# EAGLE design mainboard (EAGLE 9.6.1)
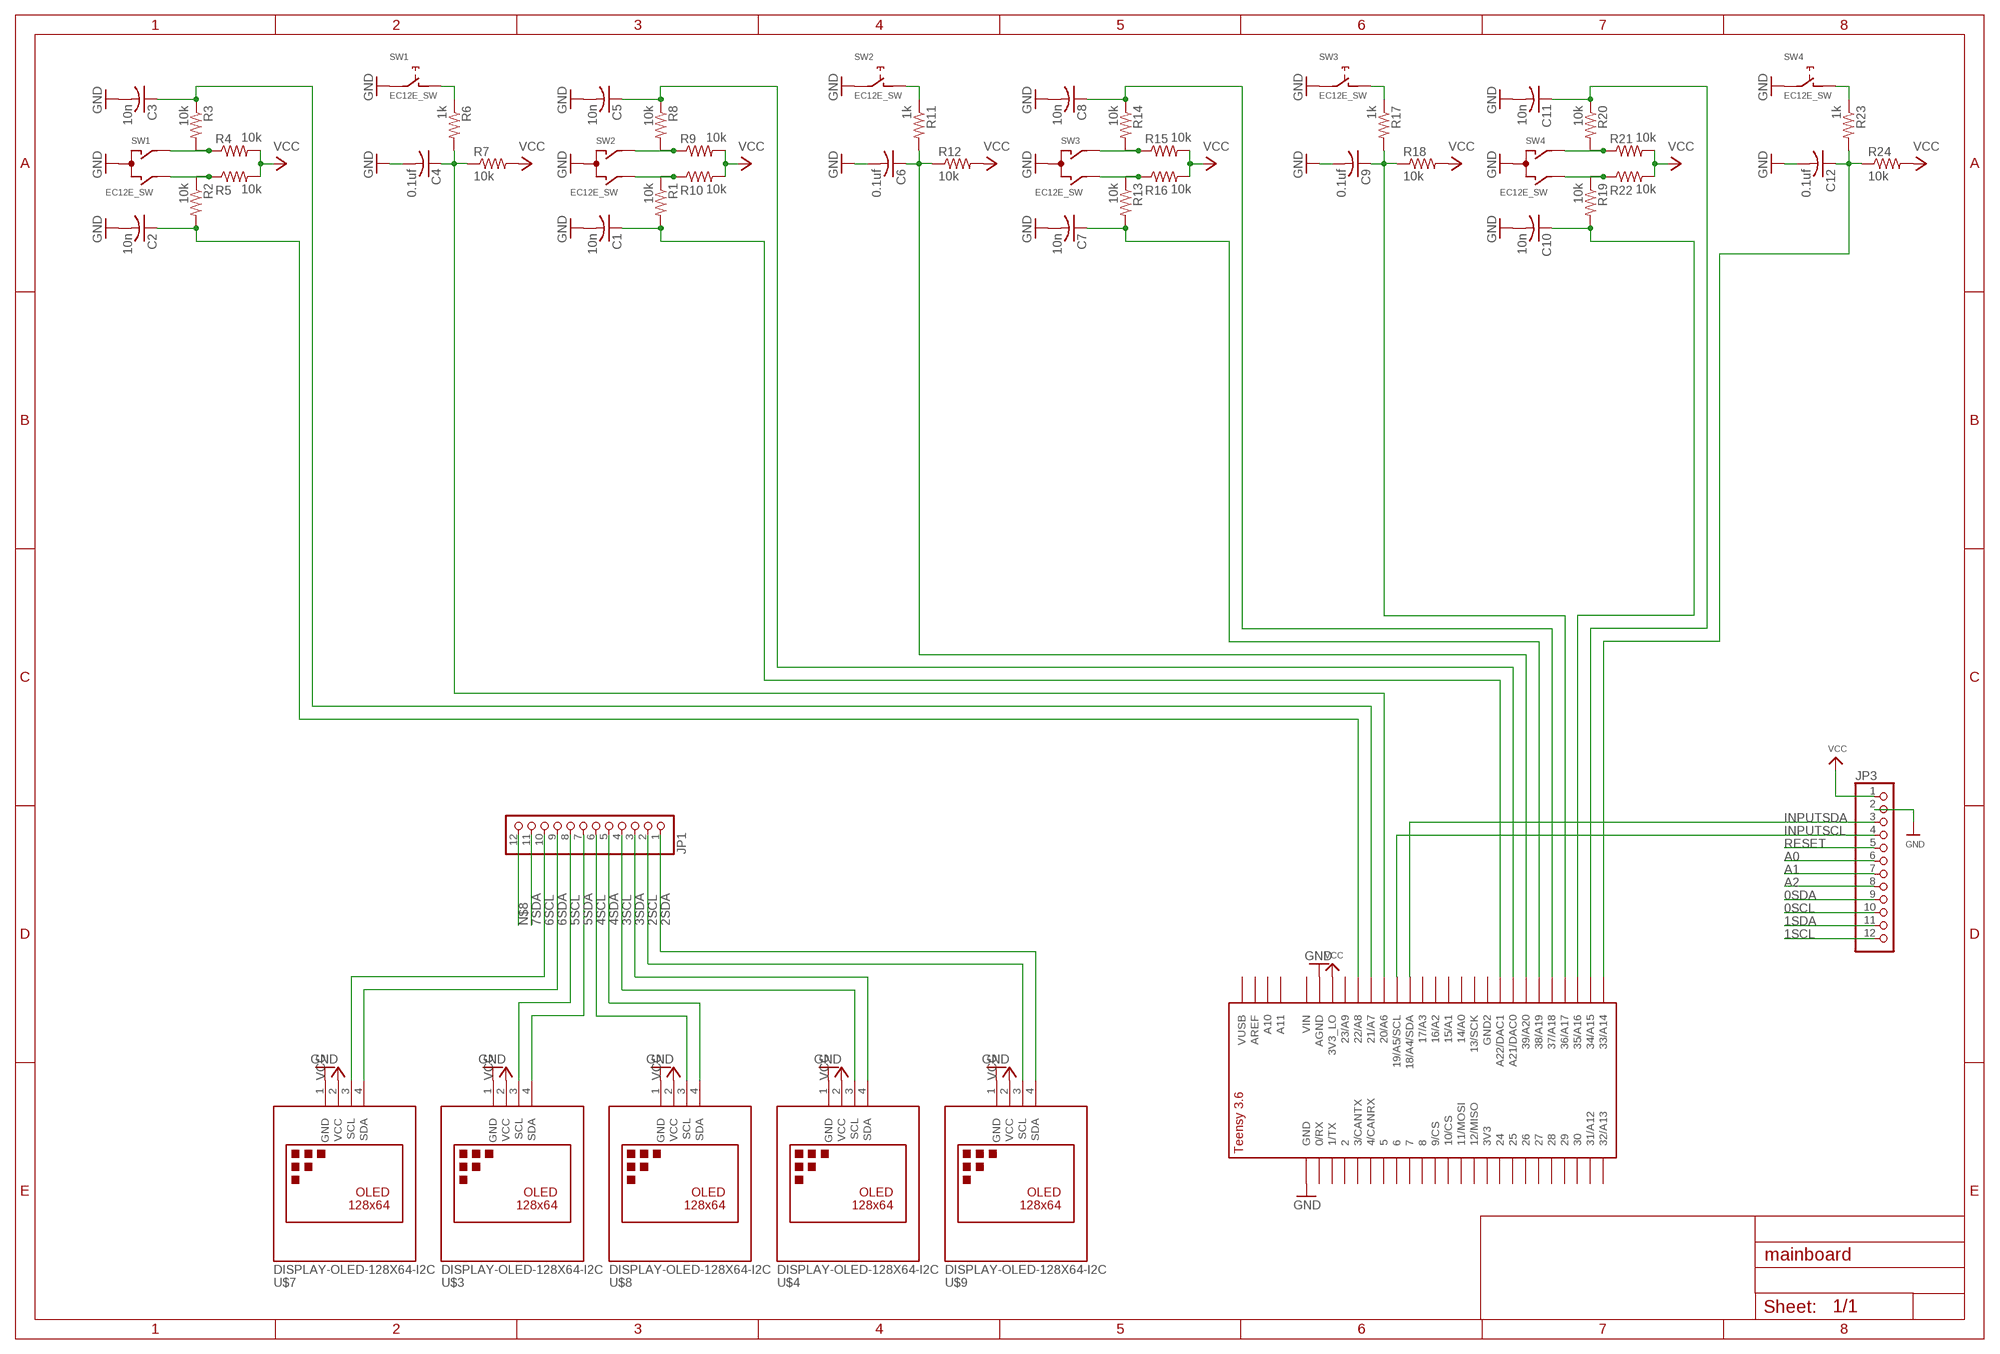
[diagram p0: schematic, sheet 1]

## Parts
C1  10n  C-US050-025X075  [C050-025X075]
C2  10n  C-US050-025X075  [C050-025X075]
C3  10n  C-US050-025X075  [C050-025X075]
C4  0.1uf  C-US050-025X075  [C050-025X075]
C5  10n  C-US050-025X075  [C050-025X075]
C6  0.1uf  C-US050-025X075  [C050-025X075]
C7  10n  C-US050-025X075  [C050-025X075]
C8  10n  C-US050-025X075  [C050-025X075]
C9  0.1uf  C-US050-025X075  [C050-025X075]
C10  10n  C-US050-025X075  [C050-025X075]
C11  10n  C-US050-025X075  [C050-025X075]
C12  0.1uf  C-US050-025X075  [C050-025X075]
JP1  HEADER-1X12  [1X12_ROUND]
JP3  HEADER-1X12  [1X12_ROUND]
R1  10k  R-US_0207/9  [0207/9]
R2  10k  R-US_0207/9  [0207/9]
R3  10k  R-US_0207/9  [0207/9]
R4  10k  R-US_0207/9  [0207/9]
R5  10k  R-US_0207/9  [0207/9]
R6  1k  R-US_0207/9  [0207/9]
R7  10k  R-US_0207/9  [0207/9]
R8  10k  R-US_0207/9  [0207/9]
R9  10k  R-US_0207/9  [0207/9]
R10  10k  R-US_0207/9  [0207/9]
R11  1k  R-US_0207/9  [0207/9]
R12  10k  R-US_0207/9  [0207/9]
R13  10k  R-US_0207/9  [0207/9]
R14  10k  R-US_0207/9  [0207/9]
R15  10k  R-US_0207/9  [0207/9]
R16  10k  R-US_0207/9  [0207/9]
R17  1k  R-US_0207/9  [0207/9]
R18  10k  R-US_0207/9  [0207/9]
R19  10k  R-US_0207/9  [0207/9]
R20  10k  R-US_0207/9  [0207/9]
R21  10k  R-US_0207/9  [0207/9]
R22  10k  R-US_0207/9  [0207/9]
R23  1k  R-US_0207/9  [0207/9]
R24  10k  R-US_0207/9  [0207/9]
SW1  EC12E_SW  [ALPS_EC12E_SW]
SW2  EC12E_SW  [ALPS_EC12E_SW]
SW3  EC12E_SW  [ALPS_EC12E_SW]
SW4  EC12E_SW  [ALPS_EC12E_SW]
U$1  TEENSY_3.5/3.6_BASIC  [TEENSY_3.5/3.6_BASIC]
U$3  DISPLAY-OLED-128X64-I2C  [DISPLAY-OLED-128X64-I2C]
U$4  DISPLAY-OLED-128X64-I2C  [DISPLAY-OLED-128X64-I2C]
U$7  DISPLAY-OLED-128X64-I2C  [DISPLAY-OLED-128X64-I2C]
U$8  DISPLAY-OLED-128X64-I2C  [DISPLAY-OLED-128X64-I2C]
U$9  DISPLAY-OLED-128X64-I2C  [DISPLAY-OLED-128X64-I2C]

## Nets
0SCL: JP3.10
0SDA: JP3.9
1SCL: JP3.12
1SDA: JP3.11
2SCL: JP1.2 U$9.3(SCL)
2SDA: JP1.1 U$9.4(SDA)
3SCL: JP1.4 U$4.3(SCL)
3SDA: JP1.3 U$4.4(SDA)
4SCL: JP1.6 U$8.3(SCL)
4SDA: JP1.5 U$8.4(SDA)
5SCL: JP1.8 U$3.3(SCL)
5SDA: JP1.7 U$3.4(SDA)
6SCL: JP1.10 U$7.3(SCL)
6SDA: JP1.9 U$7.4(SDA)
7SDA: JP1.11
A0: JP3.6
A1: JP3.7
A2: JP3.8
GND: C1.2 C2.2 C3.2 C4.2 C5.2 C6.2 C7.2 C8.2 C9.2 C10.2 C11.2 C12.2 JP3.2 SW1.C SW1.E SW2.C SW2.E SW3.C SW3.E SW4.C SW4.E U$1.AGND U$1.GND U$3.1(GND) U$4.1(GND) U$7.1(GND) U$8.1(GND) U$9.1(GND)
INPUTSCL: JP3.4 U$1.19/A5/SCL
INPUTSDA: JP3.3 U$1.18/A4/SDA
N$1: R2.1 R5.1 SW1.B
N$2: R3.2 R4.1 SW1.A
N$3: C2.1 R2.2 U$1.22/A8
N$4: R6.1 SW1.D
N$5: C3.1 R3.1 U$1.21/A7
N$6: C4.1 R6.2 R7.1 U$1.20/A6
N$7: R1.1 R10.1 SW2.B
N$8: JP1.12
N$9: R8.2 R9.1 SW2.A
N$10: C1.1 R1.2 U$1.A22/DAC1
N$11: C5.1 R8.1 U$1.21/DAC0(A21/DAC0)
N$12: R11.1 SW2.D
N$13: C6.1 R11.2 R12.1 U$1.39/A20
N$14: R13.1 R16.1 SW3.B
N$15: R14.2 R15.1 SW3.A
N$16: C7.1 R13.2 U$1.38/A19
N$17: C8.1 R14.1 U$1.37/A18
N$18: R17.1 SW3.D
N$19: C9.1 R17.2 R18.1 U$1.36/A17
N$20: R19.1 R22.1 SW4.B
N$21: R20.2 R21.1 SW4.A
N$22: C10.1 R19.2 U$1.35/A16
N$23: C11.1 R20.1 U$1.34/A15
N$24: R23.1 SW4.D
N$25: C12.1 R23.2 R24.1 U$1.33/A14
RESET: JP3.5
VCC: JP3.1 R4.2 R5.2 R7.2 R9.2 R10.2 R12.2 R15.2 R16.2 R18.2 R21.2 R22.2 R24.2 U$1.3V3_LO U$3.2(VCC) U$4.2(VCC) U$7.2(VCC) U$8.2(VCC) U$9.2(VCC)
Unconnected: SW1.GND1(G) SW1.GND2(G) SW2.GND1(G) SW2.GND2(G) SW3.GND1(G) SW3.GND2(G) SW4.GND1(G) SW4.GND2(G) U$1.0/RX U$1.1/TX U$1.2 U$1.3/CANTX U$1.3V3 U$1.4/CANRX U$1.5 U$1.6 U$1.7 U$1.8 U$1.9/CS U$1.10/CS U$1.11/MOSI U$1.12/MISO U$1.13/SCK U$1.14/A0 U$1.15/A1 U$1.16/A2 U$1.17/A3 U$1.23/A9 U$1.24 U$1.25 U$1.26 U$1.27 U$1.28 U$1.29 U$1.30 U$1.31/A12 U$1.32/A13 U$1.A10 U$1.A11 U$1.AREF U$1.GND2 U$1.VIN U$1.VUSB

## Library data of the parts
C1-C12 = adafruit:C-US: CAPACITOR, American symbol
JP1 JP3 = microbuilder:HEADER-1X12
R1-R24 = adafruit:R-US_: RESISTOR, American symbol
SW1-SW4 = switch-alps:EC12E_SW: ALPS rotary Encoder EC12E series with switch; MPN: EC12E2424407; OC_FARNELL: 1520813; OC_NEWARK: 74M1068
U$1 = Teensy356:TEENSY_3.5/3.6_BASIC
U$3 U$4 U$7-U$9 = diy-modules:DISPLAY-OLED-128X64-I2C: 128x64 Dot Matrix OLED Module based on SSD1306 chip Variant with I2C interface More details available here: http://www.instructables.com/id/Monochrome-096-i2c-OLED-display-with-arduino-SSD13/ SSD1306 datasheet: https://cdn-shop.adafruit.com/datasheets/SSD1306.pdf Click here to find device on ebay.com <http://www.ebay.com/sch/oled+display+128x64+iic> Note: There are two variants: I2C and SPI. Search for the proper version.

## Board
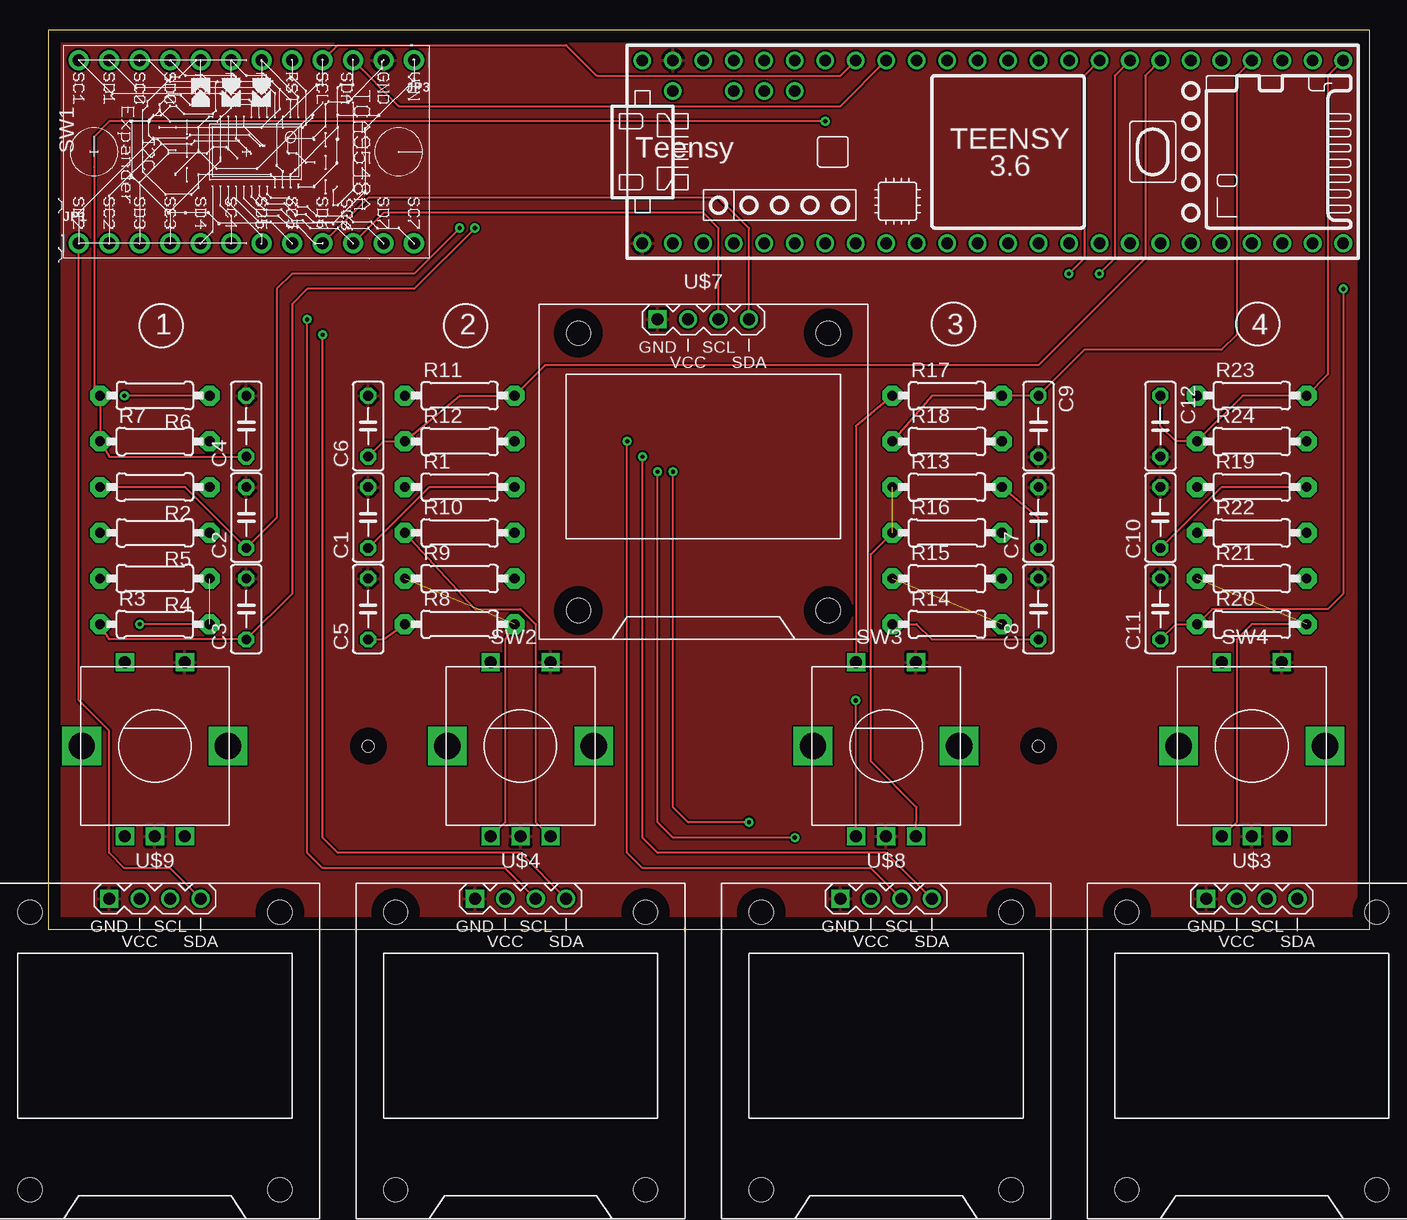
[diagram p1: board, top side]
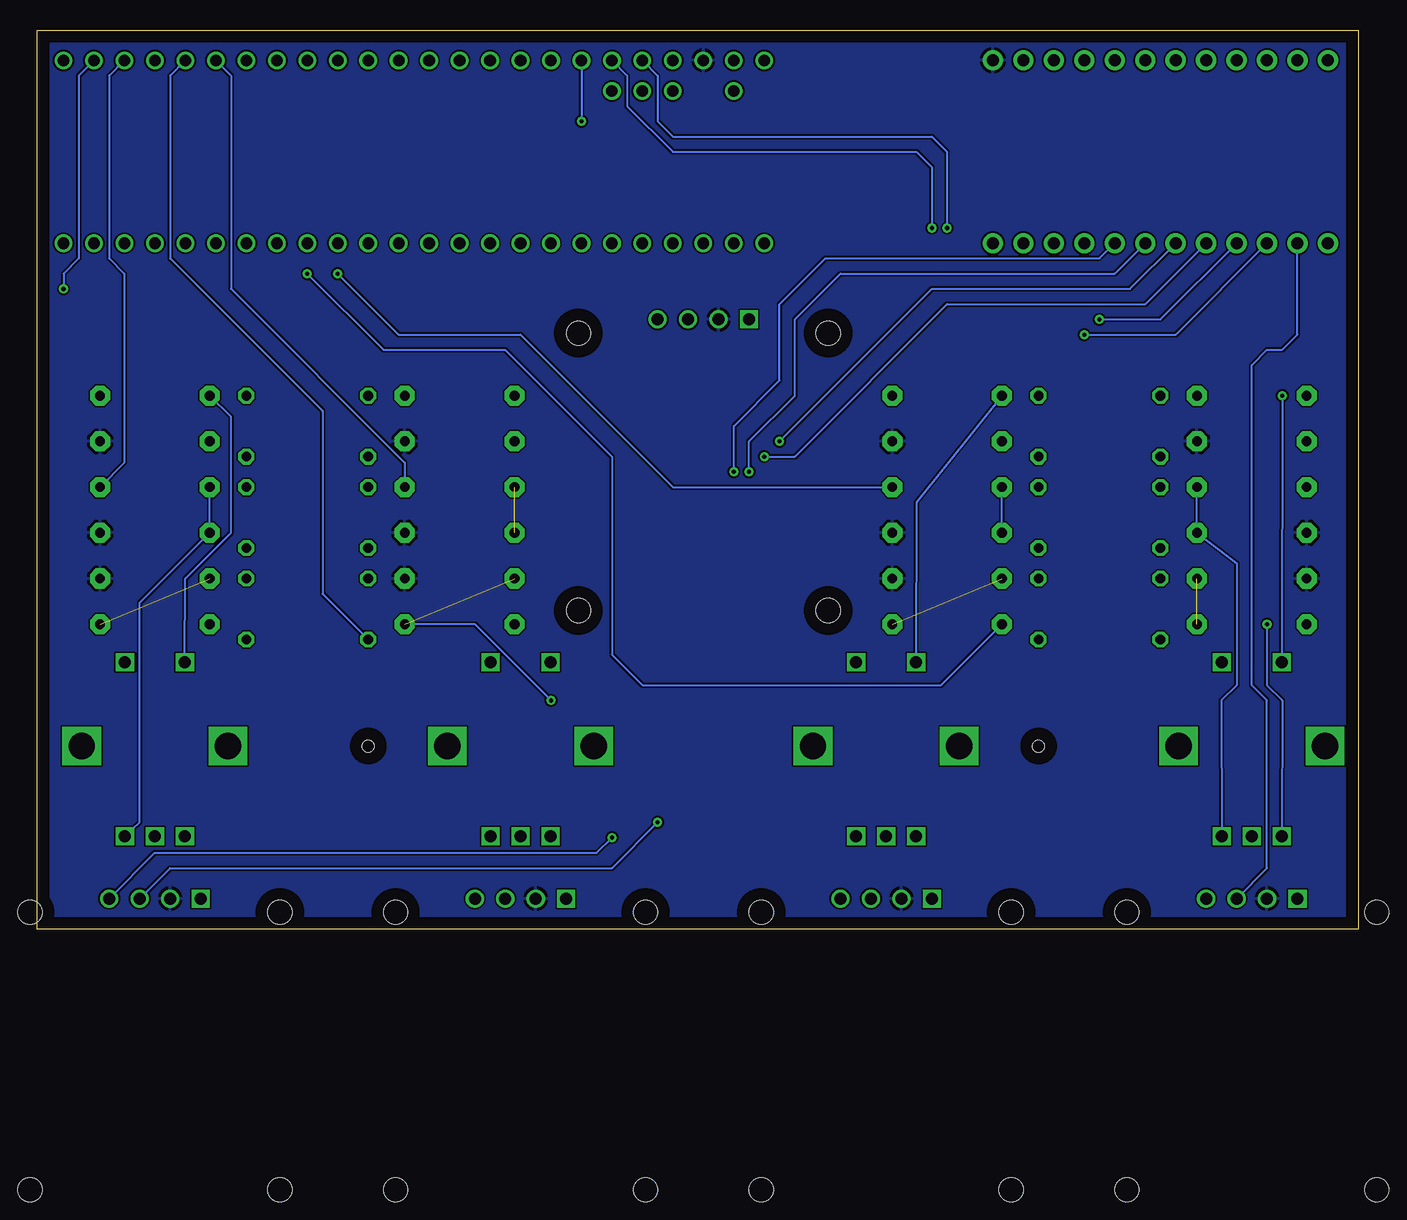
[diagram p2: board, bottom side, seen from below]

Size 110.16 x 74.92 mm. Coordinates in mm from the lower left corner, seen from the top.
Outline: 0,0 110.16,0 110.16,74.92 0,74.92 0,0
Copper layers (1*16): Top 0.035mm / dielectric 1.5mm / Bottom 0.035mm
Design rules "default": minimum track width 6mil, minimum drill 0.35mm, track to track 6mil, track to pad 6mil, pad to pad 6mil, via to via 6mil, smd to smd 6mil, copper to edge 40mil, drill to drill 6mil, minimum pad ring 10mil, minimum via ring 8mil, stop-mask expansion 4mil, vias tented up to drill 0mil, thermal gap 10mil
Holes 1 mm at 26.67,15.24 82.55,15.24

### Footprints (pad centres in the part's own frame; a part is rotated, then mirrored left to right if it is on the bottom)
C050-025X075 = drill 0.813 octagon: 1 -2.54,0; 2 2.54,0
1X12_ROUND = drill 1 pad 1.676: 1 -13.97,0; 2 -11.43,0; 3 -8.89,0; 4 -6.35,0; 5 -3.81,0; 6 -1.27,0; 7 1.27,0; 8 3.81,0; 9 6.35,0; 10 8.89,0; 11 11.43,0; 12 13.97,0
0207/9 = drill 0.813 pad 1.676 octagon: 1 -4.572,0; 2 4.572,0
ALPS_EC12E_SW = drill 1 square: A -2.5,-7.5; B 2.5,-7.5; C 0,-7.5; D -2.5,7; E 2.5,7 | drill 2.2 square: GND1 -6.1,0; GND2 6.1,0
TEENSY_3.5/3.6_BASIC = drill 0.965: 0/RX -25.4,-7.62; 1/TX -22.86,-7.62; 2 -20.32,-7.62; 3/CANTX -17.78,-7.62; 3V3 7.62,-7.62; 3V3_LO -22.86,7.62; 4/CANRX -15.24,-7.62; 5 -12.7,-7.62; 6 -10.16,-7.62; 7 -7.62,-7.62; 8 -5.08,-7.62; 9/CS -2.54,-7.62; 10/CS 0,-7.62; 11/MOSI 2.54,-7.62; 12/MISO 5.08,-7.62; 13/SCK 5.08,7.62; 14/A0 2.54,7.62; 15/A1 0,7.62; 16/A2 -2.54,7.62; 17/A3 -5.08,7.62; 18/A4/SDA -7.62,7.62; 19/A5/SCL -10.16,7.62; 20/A6 -12.7,7.62; 21/A7 -15.24,7.62; 21/DAC0 12.7,7.62; 22/A8 -17.78,7.62; 23/A9 -20.32,7.62; 24 10.16,-7.62; 25 12.7,-7.62; 26 15.24,-7.62; 27 17.78,-7.62; 28 20.32,-7.62; 29 22.86,-7.62; 30 25.4,-7.62; 31/A12 27.94,-7.62; 32/A13 30.48,-7.62; 33/A14 30.48,7.62; 34/A15 27.94,7.62; 35/A16 25.4,7.62; 36/A17 22.86,7.62; 37/A18 20.32,7.62; 38/A19 17.78,7.62; 39/A20 15.24,7.62; A10 -17.78,5.08; A11 -15.24,5.08; A22/DAC1 10.16,7.62; AGND -25.4,7.62; AREF -20.32,5.08; GND -27.94,-7.62; GND2 7.62,7.62; VIN -27.94,7.62; VUSB -25.4,5.08
DISPLAY-OLED-128X64-I2C = drill 1 square: 1 -3.81,12.7 | drill 1: 2 -1.27,12.7; 3 1.27,12.7; 4 3.81,12.7 | hole 2: -10.414,11.557; 10.414,11.557; 10.414,-11.557; -10.414,-11.557

### Placement (x,y rotation side)
C1  26.67,34.29 90 top
C2  16.51,34.29 90 top
C3  16.51,26.67 90 top
C4  16.51,41.91 90 top
C5  26.67,26.67 90 top
C6  26.67,41.91 90 top
C7  82.55,34.29 90 top
C8  82.55,26.67 90 top
C9  82.55,41.91 270 top
C10  92.71,34.29 90 top
C11  92.71,26.67 90 top
C12  92.71,41.91 270 top
JP1  16.51,57.15 0 top
JP3  16.51,72.39 180 top
R1  34.29,36.83 0 top
R2  8.89,36.83 180 top
R3  8.89,25.4 0 top
R4  8.89,29.21 180 top
R5  8.89,33.02 180 top
R6  8.89,44.45 180 top
R7  8.89,40.64 0 top
R8  34.29,25.4 0 top
R9  34.29,29.21 0 top
R10  34.29,33.02 0 top
R11  34.29,44.45 0 top
R12  34.29,40.64 0 top
R13  74.93,36.83 0 top
R14  74.93,25.4 0 top
R15  74.93,29.21 0 top
R16  74.93,33.02 0 top
R17  74.93,44.45 0 top
R18  74.93,40.64 0 top
R19  100.33,36.83 0 top
R20  100.33,25.4 0 top
R21  100.33,29.21 0 top
R22  100.33,33.02 0 top
R23  100.33,44.45 0 top
R24  100.33,40.64 0 top
SW1  8.89,15.24 0 top
SW2  39.37,15.24 0 top
SW3  69.85,15.24 0 top
SW4  100.33,15.24 0 top
U$1  77.47,64.77 0 top
U$3  100.33,-10.16 0 top
U$4  39.37,-10.16 0 top
U$7  54.61,38.1 0 top
U$8  69.85,-10.16 0 top
U$9  8.89,-10.16 0 top

### Tracks (layer width: path | path; a pad name or v marks a point on that pad's centre or on a via)
2SCL
  Bottom 0.152: U$9.3 7.62,5.08 7.62,19.05 8.89,20.32 8.89,46.99 7.62,48.26 6.35,48.26 5.08,49.53 JP1.2
2SDA
  Top 0.152: U$9.4 10.16,5.08 6.35,5.08 5.08,6.35 5.08,16.51 2.54,19.05 JP1.1
3SCL  (via drill 0.35)
  Top 0.152: U$4.3 38.1,5.08 22.86,5.08 21.59,6.35 v21.59,50.8
  Bottom 0.152: v21.59,50.8 16.51,50.8 JP1.4
3SDA  (via drill 0.35)
  Top 0.152: U$4.4 39.37,6.35 24.13,6.35 22.86,7.62 v22.86,49.53
  Bottom 0.152: v22.86,49.53 15.24,49.53 JP1.3
4SCL  (via drill 0.35)
  Top 0.152: U$8.3 68.58,5.08 49.53,5.08 48.26,6.35 v48.26,40.64
  Bottom 0.152: v48.26,40.64 35.56,53.34 19.05,53.34 JP1.6
4SDA  (via drill 0.35)
  Top 0.152: U$8.4 69.85,6.35 50.8,6.35 49.53,7.62 v49.53,39.37
  Bottom 0.152: JP1.5 17.78,52.07 34.29,52.07 46.99,39.37 v49.53,39.37
5SCL  (via drill 0.35)
  Top 0.152: v58.42,8.89 53.34,8.89 52.07,10.16 v52.07,38.1
  Bottom 0.152: U$3.3 99.06,5.08 62.23,5.08 v58.42,8.89 | JP1.8 21.59,55.88 44.45,55.88 48.26,52.07 48.26,45.72 52.07,41.91 v52.07,38.1
5SDA  (via drill 0.35)
  Top 0.152: v62.23,7.62 52.07,7.62 50.8,8.89 v50.8,38.1
  Bottom 0.152: U$3.4 100.33,6.35 63.5,6.35 v62.23,7.62 | v50.8,38.1 50.8,40.64 46.99,44.45 46.99,50.8 43.18,54.61 20.32,54.61 JP1.7
6SCL
  Top 0.152: U$7.3 55.88,58.42 54.61,59.69 27.94,59.69 JP1.10
6SDA
  Top 0.152: U$7.4 58.42,58.42 55.88,60.96 26.67,60.96 JP1.9
GND
  pour Top: -3.81,74.93 1.27,81.28 107.95,81.28 114.3,74.93 114.3,1.27 110.49,-3.81 -2.54,-3.81 -5.08,-1.27
INPUTSCL
  Top 0.152: JP3.4 24.13,73.66 43.18,73.66 45.72,71.12 66.04,71.12 U$1.19/A5/SCL
INPUTSDA
  Top 0.152: JP3.3 29.21,68.58 66.04,68.58 U$1.18/A4/SDA
N$1
  Bottom 0.152: R2.1 R5.1 10.16,30.48 10.16,20.32 11.43,19.05 SW1.B
N$2  (via drill 0.35)  (1 unrouted)
  Top 0.152: R3.2 v7.62,25.4
  Bottom 0.152: v7.62,25.4 7.62,20.32 6.35,19.05 SW1.A
N$3  (via drill 0.35)
  Top 0.152: R2.2 11.43,36.83 C2.1 19.05,34.29 19.05,53.34 20.32,54.61 30.48,54.61 v34.29,58.42
  Bottom 0.152: U$1.22/A8 58.42,71.12 58.42,67.31 57.15,66.04 35.56,66.04 34.29,64.77 v34.29,58.42
N$4  (via drill 0.35)
  Top 0.152: R6.1 v6.35,44.45
  Bottom 0.152: v6.35,44.45 SW1.D
N$5  (via drill 0.35)
  Top 0.152: R3.1 5.08,24.13 C3.1 20.32,27.94 20.32,52.07 21.59,53.34 30.48,53.34 v35.56,58.42
  Bottom 0.152: U$1.21/A7 60.96,71.12 60.96,68.58 57.15,64.77 36.83,64.77 35.56,63.5 v35.56,58.42
N$6  (via drill 0.35)
  Top 0.152: C4.1 5.08,39.37 R7.1 R6.2 3.81,44.45 3.81,66.04 5.08,67.31 v64.77,67.31
  Bottom 0.152: U$1.20/A6 v64.77,67.31
N$7
  Top 0.152: R10.1 35.56,26.67 39.37,26.67 40.64,25.4 40.64,8.89 SW2.B
  Bottom 0.152: R10.1 R1.1
N$9  (1 unrouted)
  Top 0.152: R8.2 38.1,24.13 38.1,8.89 SW2.A
N$10  (via drill 0.35)
  Top 0.152: R1.2 31.75,36.83 C1.1 | U$1.A22/DAC1 86.36,71.12 86.36,55.88 v85.09,54.61
  Bottom 0.152: v85.09,54.61 80.01,49.53 69.85,49.53 57.15,36.83 R1.2
N$11  (via drill 0.35)
  Top 0.152: C5.1 27.94,24.13 R8.1 | U$1.21/DAC0 88.9,71.12 88.9,55.88 v87.63,54.61
  Bottom 0.152: v87.63,54.61 81.28,48.26 71.12,48.26 62.23,39.37 62.23,22.86 59.69,20.32 34.8,20.32 R8.1
N$12
  Bottom 0.152: R11.1 36.83,35.56 SW2.D
N$13
  Top 0.152: C6.1 27.94,40.64 R12.1 34.29,44.45 R11.2 41.4,46.99 82.55,46.99 91.44,55.88 91.44,71.12 U$1.39/A20
N$14  (1 unrouted)
  Top 0.152: SW3.B 72.39,10.16 68.58,13.97 68.58,31.24 R16.1
N$15  (via drill 0.35)  (1 unrouted)
  Top 0.152: SW3.A v67.31,19.05
  Bottom 0.152: v67.31,19.05 73.66,25.4 R14.2
N$16
  Top 0.152: C7.1 82.55,34.29 R13.2
  Bottom 0.152: U$1.38/A19 93.98,71.12 93.98,53.34 79.5,38.86 R13.2
N$17
  Top 0.152: R14.1 72.39,25.4 73.66,24.13 C8.1
  Bottom 0.152: U$1.37/A18 99.06,71.12 99.06,55.88 86.36,43.18 86.36,27.94 C8.1
N$18
  Top 0.152: R17.1 67.31,41.91 SW3.D
N$19
  Top 0.152: R18.1 73.66,44.45 R17.2 C9.1 86.36,48.26 97.79,48.26 99.06,49.53 99.06,71.12 U$1.36/A17
N$20
  Bottom 0.152: SW4.B 101.6,8.89 101.6,27.18 R22.1 R19.1
N$21  (1 unrouted)
  Top 0.152: SW4.A 99.06,8.89 99.06,24.13 100.33,25.4 R20.2
N$22
  Top 0.152: R19.2 97.79,36.83 C10.1
  Bottom 0.152: U$1.35/A16 104.14,71.12 104.14,55.88 102.87,54.61 102.87,38.86 R19.2
N$23  (via drill 0.35)
  Top 0.152: C11.1 93.98,25.4 R20.1 97.03,26.67 106.68,26.67 107.95,27.94 v107.95,53.34
  Bottom 0.152: U$1.34/A15 106.68,71.12 106.68,55.88 107.95,54.61 v107.95,53.34
N$24
  Bottom 0.152: SW4.D 97.79,29.21 93.98,33.02 93.98,42.67 R23.1
N$25
  Top 0.152: C12.1 92.71,41.91 93.98,40.64 R24.1 99.57,44.45 R23.2 106.68,46.23 106.68,71.12 U$1.33/A14
VCC
  pour Bottom: -7.62,72.39 -1.27,82.55 114.3,82.55 116.84,-6.35 -6.35,-6.35

### Text on the board
_tsilk: Teensy | 1 | 2 | 3 | 4